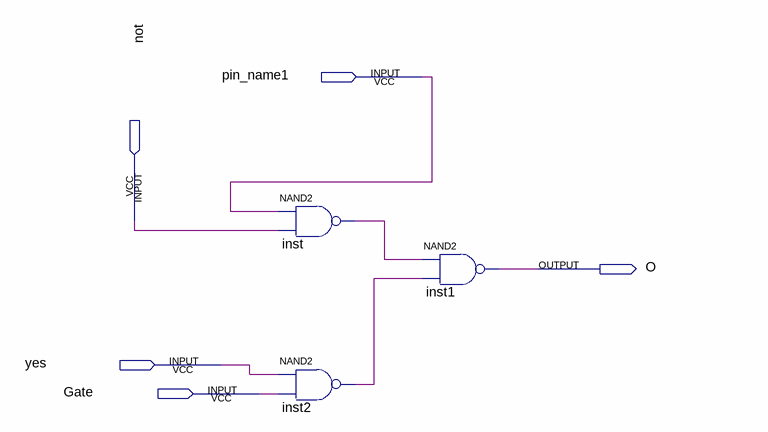
[diagram p0: schematic sheet]
// Quartus schematic nan.bdf as structural Verilog: 3 symbols, 5 pins
module nan (
  input  pin_name1,
  input  \not ,
  input  yes,
  input  Gate,
  output O
);

  wire inst2_out, inst_out;

  nand inst (inst_out, pin_name1, \not );
  nand inst2 (inst2_out, yes, Gate);
  nand inst1 (O, inst_out, inst2_out);
endmodule
